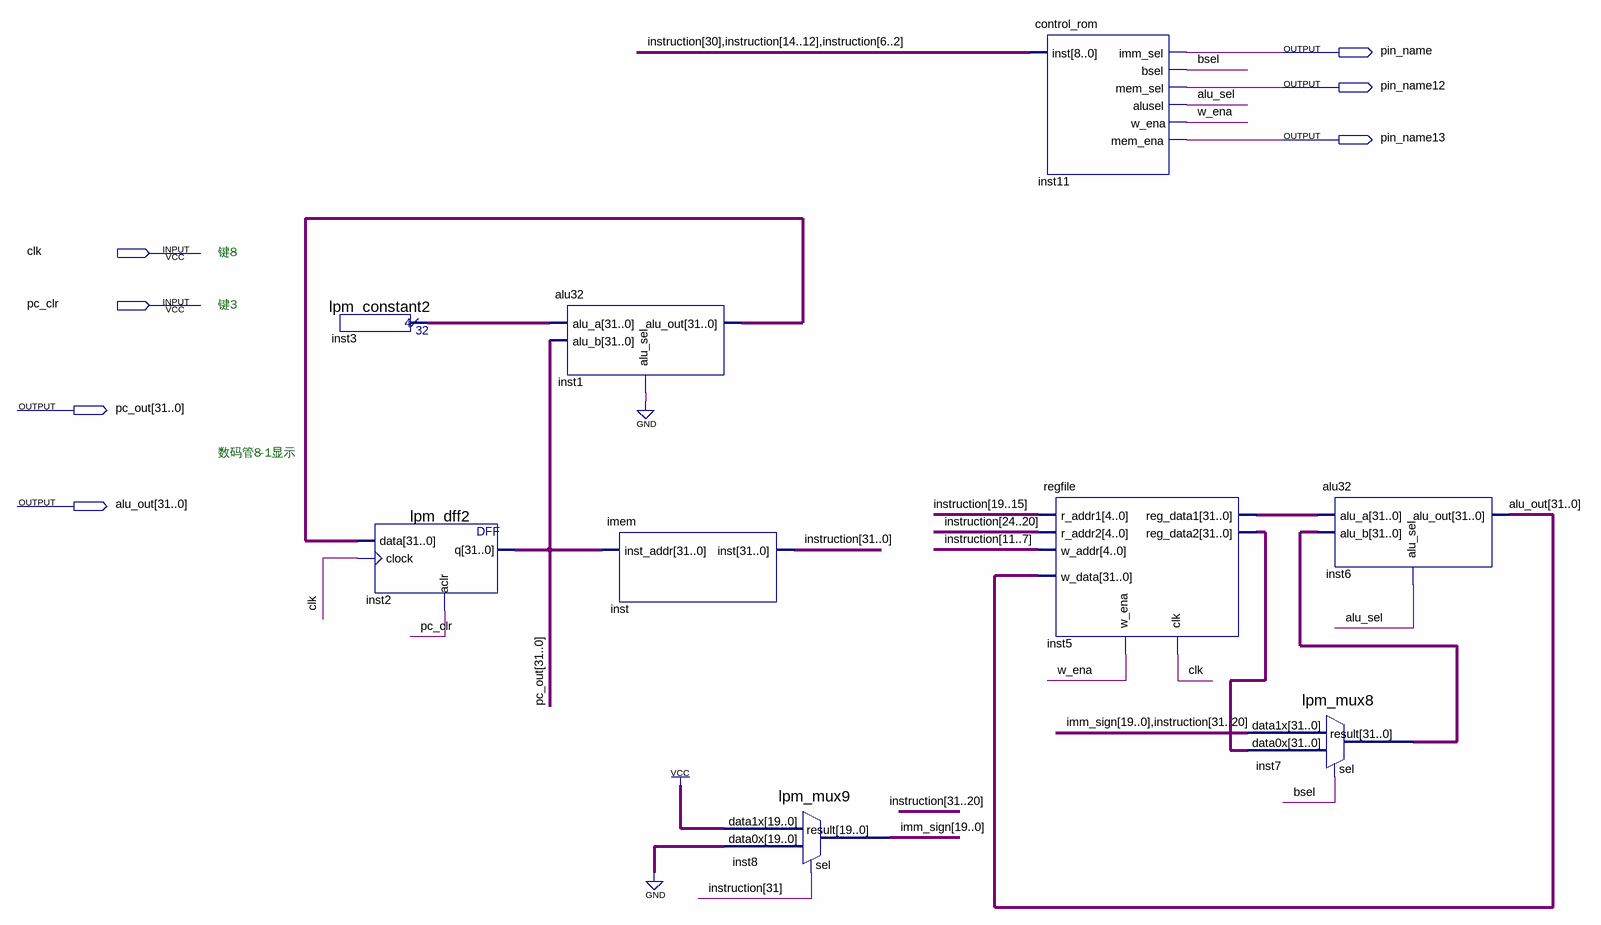
[diagram p0: schematic sheet]
// Quartus schematic risc5.bdf as structural Verilog: 9 symbols, 7 pins
module risc5 (
  input  clk,
  input  pc_clr,
  output pin_name,
  output pin_name12,
  output pin_name13,
  output [31:0] pc_out,
  output [31:0] alu_out
);

  wire alu_sel, bsel, w_ena;
  wire [19:0] imm_sign;
  wire [31:0] inst1_alu_out, inst3_result, inst5_reg_data1, inst5_reg_data2, inst7_result, instruction;

  lpm_constant2 inst3 (.result(inst3_result));
  lpm_dff2 inst2 (.data(inst1_alu_out), .clock(clk), .aclr(pc_clr), .q(pc_out));
  alu32 inst1 (.alu_a(inst3_result), .alu_b(pc_out), .alu_sel(1'b0), .alu_out(inst1_alu_out));
  imem inst (.inst_addr(pc_out), .inst(instruction));
  lpm_mux9 inst8 (.data1x({20{1'b1}}), .data0x({20{1'b0}}), .sel(instruction[31]), .result(imm_sign));
  control_rom inst11 (
    .inst({instruction[30], instruction[14:12], instruction[6:2]}), .imm_sel(pin_name), .bsel(bsel),
    .mem_sel(pin_name12), .alusel(alu_sel), .w_ena(w_ena), .mem_ena(pin_name13));
  regfile inst5 (
    .clk(clk), .w_ena(w_ena), .r_addr1(instruction[19:15]), .r_addr2(instruction[24:20]),
    .w_addr(instruction[11:7]), .w_data(alu_out), .reg_data1(inst5_reg_data1), .reg_data2(inst5_reg_data2));
  lpm_mux8 inst7 (.data1x({imm_sign, instruction[31:20]}), .data0x(inst5_reg_data2), .sel(bsel), .result(inst7_result));
  alu32 inst6 (.alu_a(inst5_reg_data1), .alu_b(inst7_result), .alu_sel(alu_sel), .alu_out(alu_out));

  // Notes on the sheet:
  //   键8
  //   键3
  //   数码管8-1显示
endmodule
